# Altium schematic sheet FPGA_PWR .SchDoc
size A4; SheetNumber: 4; SheetTotal: 10
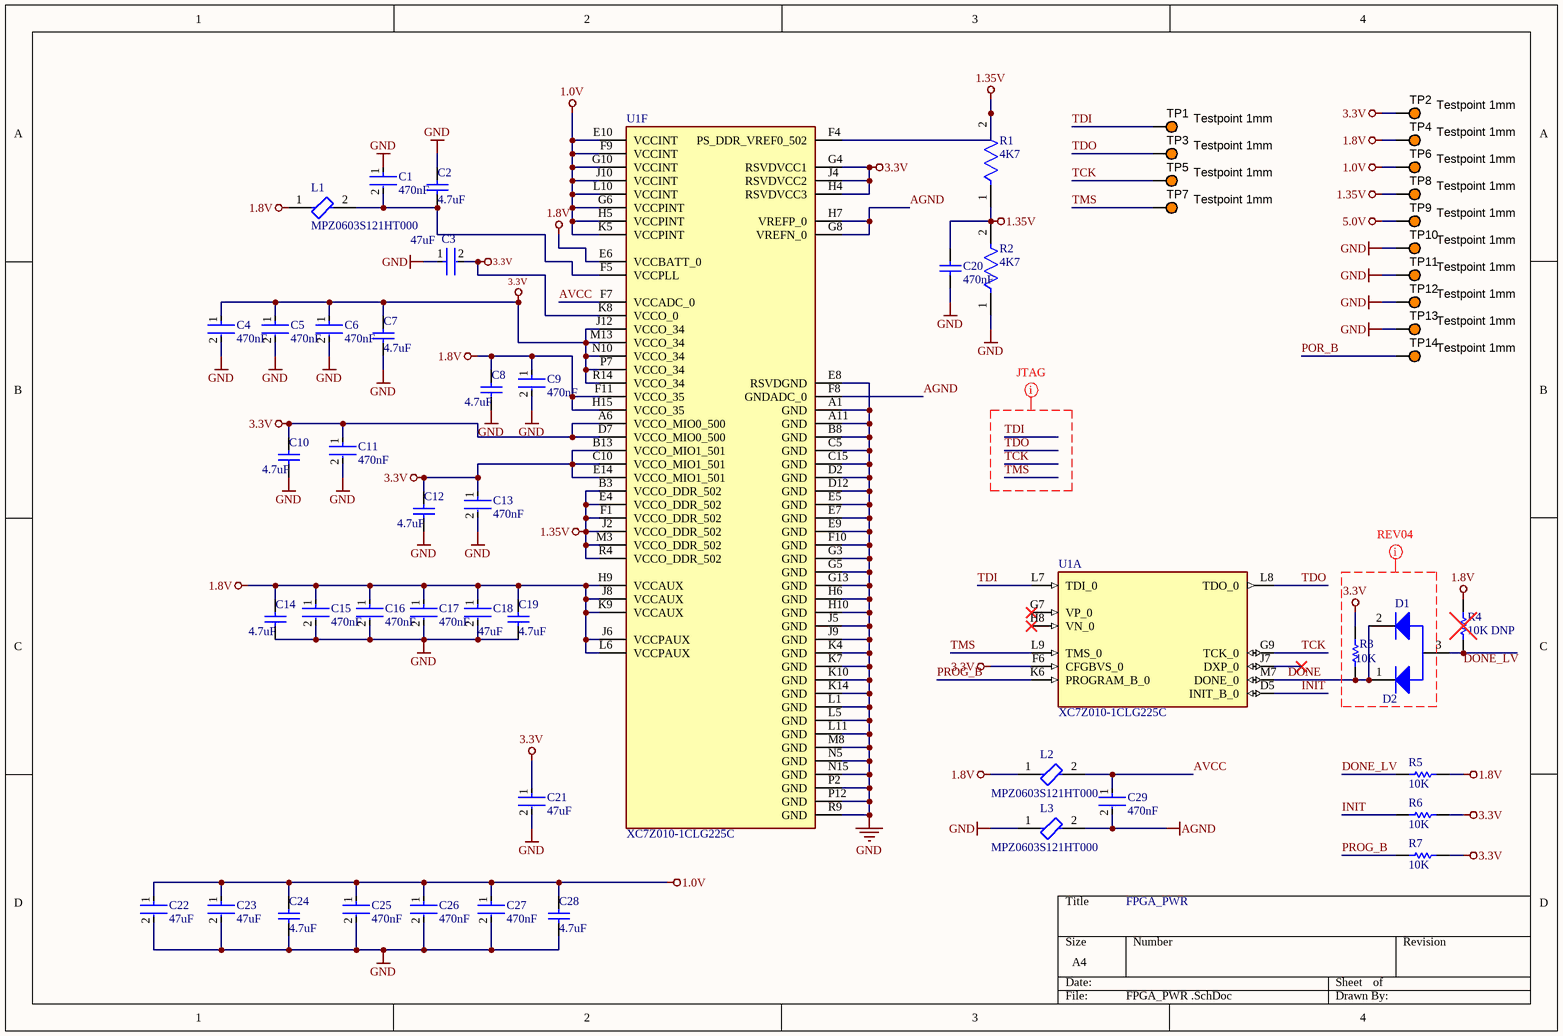
[diagram p0: FPGA_PWR .SchDoc]

## Parts
C1  470nF  [FP-0402-L_1_0_0_05-W_0_5-MFG]
C2  4.7uF  [CAPC1005X71X25NL10T15]
C3  47uF  [FP-GRM219-0_2-0_1-IPC_A]
C4  470nF  [FP-0402-L_1_0_0_05-W_0_5-MFG]
C5  470nF  [FP-0402-L_1_0_0_05-W_0_5-MFG]
C6  470nF  [FP-0402-L_1_0_0_05-W_0_5-MFG]
C7  4.7uF  [CAPC1005X71X25NL10T15]
C8  4.7uF  [CAPC1005X71X25NL10T15]
C9  470nF  [FP-0402-L_1_0_0_05-W_0_5-MFG]
C10  4.7uF  [CAPC1005X71X25NL10T15]
C11  470nF  [FP-0402-L_1_0_0_05-W_0_5-MFG]
C12  4.7uF  [CAPC1005X71X25NL10T15]
C13  470nF  [FP-0402-L_1_0_0_05-W_0_5-MFG]
C14  4.7uF  [CAPC1005X71X25NL10T15]
C15  470nF  [FP-0402-L_1_0_0_05-W_0_5-MFG]
C16  470nF  [FP-0402-L_1_0_0_05-W_0_5-MFG]
C17  470nF  [FP-0402-L_1_0_0_05-W_0_5-MFG]
C18  47uF  [FP-GRM219-0_2-0_1-IPC_A]
C19  4.7uF  [CAPC1005X71X25NL10T15]
C20  470nF  [CAPC1005X56X25LL10T15]
C21  47uF  [FP-GRM219-0_2-0_1-IPC_A]
C22  47uF  [FP-GRM219-0_2-0_1-IPC_A]
C23  47uF  [FP-GRM219-0_2-0_1-IPC_A]
C24  4.7uF  [CAPC1005X71X25NL10T15]
C25  470nF  [FP-0402-L_1_0_0_05-W_0_5-MFG]
C26  470nF  [FP-0402-L_1_0_0_05-W_0_5-MFG]
C27  470nF  [FP-0402-L_1_0_0_05-W_0_5-MFG]
C28  4.7uF  [CAPC1005X71X25NL10T15]
C29  470nF  [FP-0402-L_1_0_0_05-W_0_5-MFG]
D1  D2  [ONSC-SOT-323-3-419-04_V]
L1  MPZ0603S121HT000  [FP-MPZ0603-IPC_C]
L2  MPZ0603S121HT000  [FP-MPZ0603-IPC_C]
L3  MPZ0603S121HT000  [FP-MPZ0603-IPC_C]
R1  4K7  [FP-AC0402-MFG]
R2  4K7  [FP-AC0402-MFG]
R3  10K  [RESC1005X40X25LL10T10]
R4  10K DNP  [RESC1005X40X25LL10T10]
R5  10K  [RESC1005X40X25LL10T10]
R6  10K  [RESC1005X40X25LL10T10]
R7  10K  [RESC1005X40X25LL10T10]
TP1  Testpoint 1mm  [KSTN-5003]
TP2  Testpoint 1mm  [KSTN-5003]
TP3  Testpoint 1mm  [KSTN-5003]
TP4  Testpoint 1mm  [KSTN-5003]
TP5  Testpoint 1mm  [KSTN-5003]
TP6  Testpoint 1mm  [KSTN-5003]
TP7  Testpoint 1mm  [KSTN-5003]
TP8  Testpoint 1mm  [KSTN-5003]
TP9  Testpoint 1mm  [KSTN-5003]
TP10  Testpoint 1mm  [KSTN-5003]
TP11  Testpoint 1mm  [KSTN-5003]
TP12  Testpoint 1mm  [KSTN-5003]
TP13  Testpoint 1mm  [KSTN-5003]
TP14  Testpoint 1mm  [KSTN-5003]
U1  XC7Z010-1CLG225C  [BGA225C80P15X15_1300X1300X150]  (parts A,F of 6)

## Nets
1.0V: C22.1 C23.1 C24.2 C25.1 C26.1 C27.1 C28.2 TP6.1 U1.E10(VCCINT) U1.F9(VCCINT) U1.G6(VCCPINT) U1.G10(VCCINT) U1.H5(VCCPINT) U1.J10(VCCINT) U1.K5(VCCPINT) U1.L10(VCCINT)
1.8V: C8.2 C9.1 C14.2 C15.1 C16.1 C17.1 C18.1 C19.2 L1.1 L2.1 R4.2 R5.2 TP4.1 U1.E6(VCCBATT_0) U1.F11(VCCO_35) U1.H9(VCCAUX) U1.H15(VCCO_35) U1.J6(VCCPAUX) U1.J8(VCCAUX) U1.K9(VCCAUX) U1.L6(VCCPAUX)
1.35V: C20.2 R1.1 R1.2 R2.2 TP8.1 U1.B3(VCCO_DDR_502) U1.E4(VCCO_DDR_502) U1.F1(VCCO_DDR_502) U1.F4(PS_DDR_VREF0_502) U1.J2(VCCO_DDR_502) U1.M3(VCCO_DDR_502) U1.R4(VCCO_DDR_502)
3.3V: C3.2 C4.1 C5.1 C6.1 C7.2 C10.2 C11.1 C12.2 C13.1 C21.1 R3.2 R6.2 R7.2 TP2.1 U1.A6(VCCO_MIO0_500) U1.B13(VCCO_MIO1_501) U1.C10(VCCO_MIO1_501) U1.D7(VCCO_MIO0_500) U1.E14(VCCO_MIO1_501) U1.F6(CFGBVS_0) U1.G4(RSVDVCC1) U1.H4(RSVDVCC3) U1.J4(RSVDVCC2) U1.J12(VCCO_34) U1.K8(VCCO_0) U1.M13(VCCO_34) U1.N10(VCCO_34) U1.P7(VCCO_34) U1.R14(VCCO_34)
5.0V: TP9.1
AGND: C29.2 L3.2 U1.F8(GNDADC_0) U1.G8(VREFN_0) U1.H7(VREFP_0)
GND: C1.1 C2.2 C3.1 C4.2 C5.2 C6.2 C7.1 C8.1 C9.2 C10.1 C11.2 C12.1 C13.2 C14.1 C15.2 C16.2 C17.2 C18.2 C19.1 C20.1 C21.2 C22.2 C23.2 C24.1 C25.2 C26.2 C27.2 C28.1 L3.1 R2.1 TP10.1 TP11.1 TP12.1 TP13.1 U1.A1(GND) U1.A11(GND) U1.B8(GND) U1.C5(GND) U1.C15(GND) U1.D2(GND) U1.D12(GND) U1.E5(GND) U1.E7(GND) U1.E8(RSVDGND) U1.E9(GND) U1.F10(GND) U1.G3(GND) U1.G5(GND) U1.G13(GND) U1.H6(GND) U1.H10(GND) U1.J5(GND) U1.J9(GND) U1.K4(GND) U1.K7(GND) U1.K10(GND) U1.K14(GND) U1.L1(GND) U1.L5(GND) U1.L11(GND) U1.M8(GND) U1.N5(GND) U1.N15(GND) U1.P2(GND) U1.P12(GND) U1.R9(GND)
AVCC: C29.1 L2.2 U1.F7(VCCADC_0)
DONE: D1.1(K1) D1.2(K2) R3.1 U1.M7(DONE_0)
DONE_LV: R5.1
INIT: R6.1 U1.D5(INIT_B_0)
POR_B: TP14.1
PROG_B: R7.1 U1.K6(PROGRAM_B_0)
TCK: TP5.1 U1.G9(TCK_0)
TDI: TP1.1 U1.L7(TDI_0)
TDO: TP3.1 U1.L8(TDO_0)
TMS: TP7.1 U1.L9(TMS_0)
NetC1_2: C1.2 C2.1 L1.2 U1.F5(VCCPLL)
NetD1_3: D1.3(A) R4.1

Not connected (* = marked no-connect by the designer): U1 G7(VP_0)* H8(VN_0)* J7(DXP_0)*

## Layout directives
mark named REV04: 3.3V
mark named JTAG: TCK, TDI, TDO, TMS

## Notes on the sheet
- FPGA_PWR
- Labels drawn without touching a wire or pin: DONE_LV

## Library data of the parts
C1 C4-C6 C9 C11 C13 C15-C17 C25-C27 C29 = CMP-14477-002186-2: None; Tolerance: 20%; Voltage Rating: 6.3V; Capacitance: 470nF; Case Code (Imperial): 0402; Mount: Surface Mount; Packaging: Tape and Reel; Width: 0.02inch; Case Code (Metric): 1005; Case/Package: 0402; RoHS Compliant: Yes; Length: 0.039inch; Thickness: 0.008inch; Max Operating Temperature: 85°C; Min Operating Temperature: -55°C
C2 C7 C8 C10 C12 C14 C19 C24 C28 = CMP-2008-02043-1: Part Number: 0402ZD475MAT2A; Manufacturer: AVX Interconnect / Elco
C3 C18 C21-C23 = CMP-06035-004086-1: Chip Multilayer Ceramic Capacitors for General Purpose, 0805, 47uF, X5R, 15%, 20%, 6.3V; Case Code (Metric): 2012; Voltage Rating: 6.3V; Case Code (Imperial): 0805; Max Operating Temperature: 85°C; Width: 0.049inch; Length: 0.079inch; Min Operating Temperature: -55°C; Mount: Surface Mount; Packaging: Tape and Reel; Case/Package: 0805; Thickness: 0.037inch; Capacitance: 47uF; Tolerance: 20%
C20 = CMP-1034-02103-2: Manufacturer: AVX Interconnect / Elco; Part Number: 04026D474KAT2A
D1 = CMP-1055-00555-1: Schottky Barrier Diodes, 3-Pin SOT-323, Pb-Free, Tape and Reel; PartNumber: BAT54AWT1G; Manufacturer: On Semiconductor; trr Max (ns): 5; IFSM Max (A): 0.6; Configuration: Common Anode; ComponentLink3URL: http://www.onsemi.com/pub_link/Collateral/419-04.PDF; ComponentLink2Description: Datasheet; ComponentLink2URL: http://www.onsemi.cn/pub_link/Collateral/BAT54AWT1-D.PDF; DatasheetVersion: Rev. 3; PackageVersion: Rev. N, 11/2008; ComponentLink3Description: Package Specification; ComponentLink1Description: Manufacturer URL; ComponentLink1URL: http://www.onsemi.com/; Packing: Tape and Reel; Mounting Technology: Surface Mount; PackageDescription: 3-Pin Small Outline Transistor, Body 2 x 1.25 mm, Pitch 0.65 mm; RoHS: TRUE; PackageReference: SOT-323-3-419-04
L1-L3 = CMP-08257-000447-1: CHIP BEADS FOR GENERAL SIGNAL LI; Max Current Rating: 1A; DC Resistance (DCR): 130mR; Number of Lines: 1; Min Operating Temperature: -55°C; Mount: Surface Mount; Case Code (Imperial): 0201; Case Code (Metric): 0603; Max Operating Temperature: 125°C; RoHS Compliant: Yes; Packaging: Cut Tape; Case/Package: 0201
R1 R2 = CMP-03412-009386-2: RES 4.7kΩ ±1% 0.063W 0402
R3-R7 = CMP-2002-04584-1: Manufacturer: KOA Speer; Part Number: SG73P1ETTP1002F
TP1-TP14 = CMP-1672-00009-1: Test Point, Orange, 1-Pin THD, RoHS; Peak Reverse Current: 600 uA; Forward Current: 3 A; Max Surge Current: 80 A; Forward Voltage: 1.08 V; Max Operating Temperature: 150 degC; PackageReference: 5003; Pins: 2; ComponentLink2URL: http://keyelco.com/userAssets/file/M65p56.pdf; PackageDescription: 1-Pin Through Hole Device, Dia 2.54 mm; Weight: 0.01 lb; Diameter: 5.3 mm; Mount: Through Hole; Package Quantity: 500; Packaging: Bulk; Min Operating Temperature: -65 degC; ComponentLink1Description: Manufacturer URL; Height: 0.25 inch; ComponentLink1URL: http://www.keyelco.com/; ComponentLink2Description: Datasheet; Width: 0.25 inch; REACH SVHC: No SVHC; RoHSCompliant: true; Radiation Hardening: No; Length: 9.5 mm; DatasheetVersion: Jun-15
U1 = XC7Z010-1CLG225C: Dual ARMÂ® CortexÂ®-A9 MPCoreâ„¢ with CoreSightâ„¢ System On Chip _SOC_ IC ZynqÂ®-7000 Artixâ„¢-7 FPGA, 28K Logic Cells 667MHz 225-CSPBGA _13x13_; MF: Xilinx Inc.; Value: *; SnapEDA_Link: https://www.snapeda.com/parts/XC7Z010-1CLG225C/Xilinx%20Inc./view-part/45778/?ref=snap; Digi-Key_Part_Number: 122-1855-ND; Package: CSPBGA-225 Xilinx; Digi-Key_Purchase_URL: https://www.digikey.by/product-detail/en/xilinx-inc/XC7Z010-1CLG225C/122-1855-ND/3925788?utm_source=snapeda&utm_medium=aggregator&utm_campaign=symbol; MP: XC7Z010-1CLG225C